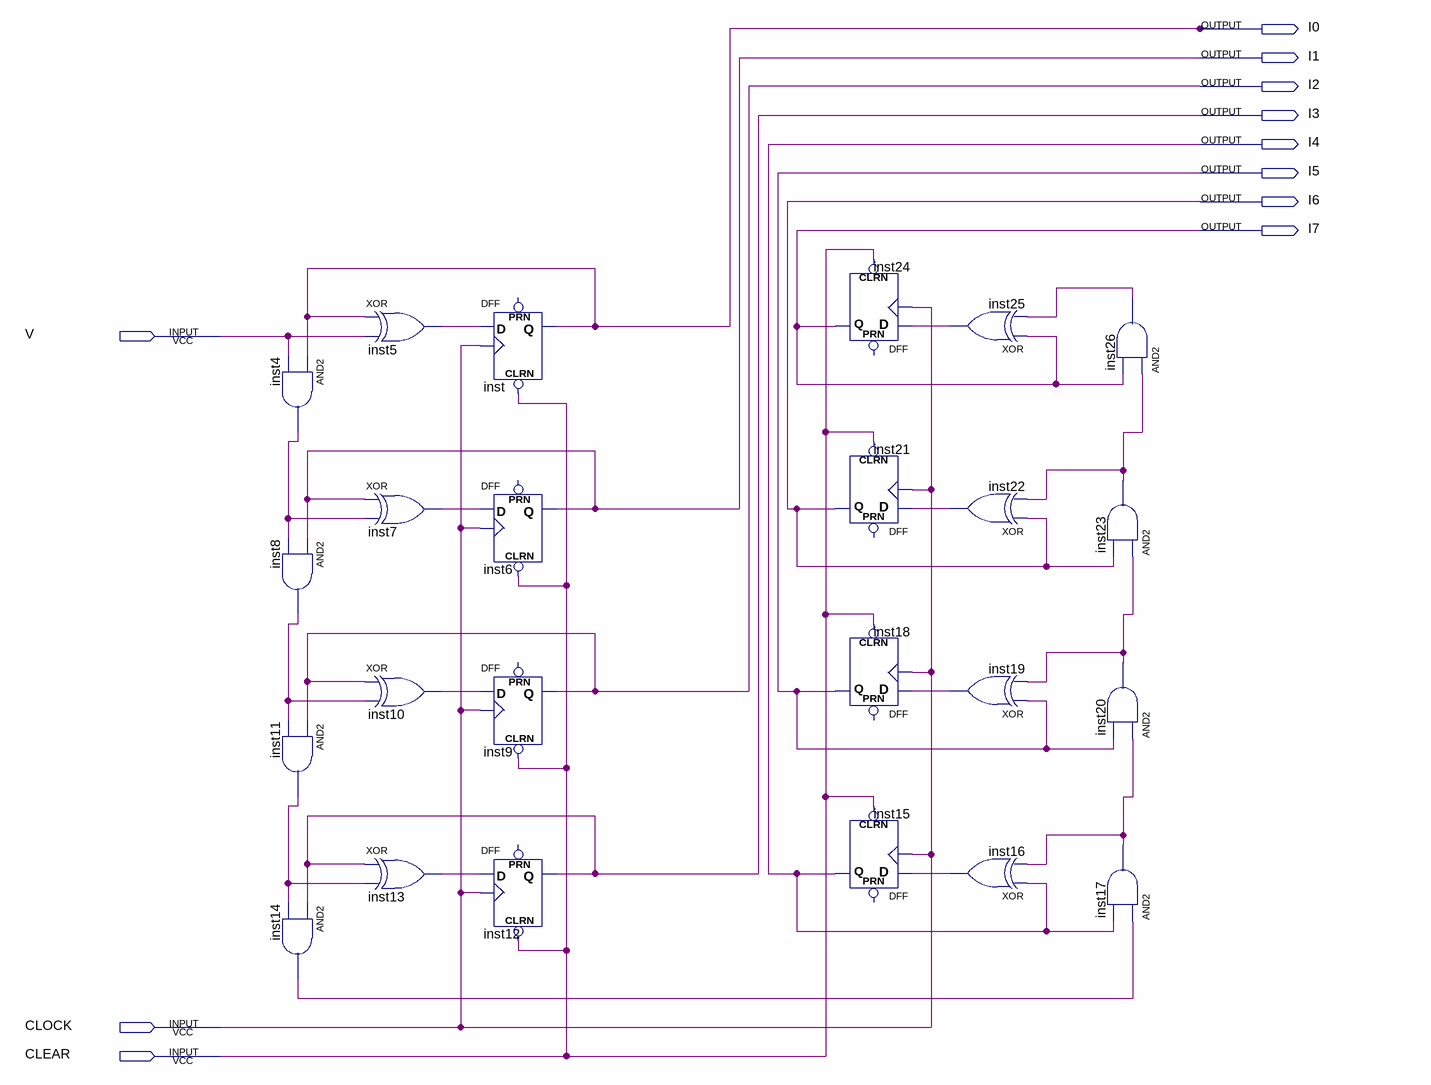
[diagram p0: schematic sheet]
// Quartus schematic 8b_syn_d_counter.bdf as structural Verilog: 24 symbols, 11 pins
module \8b_syn_d_counter  (
  input  V,
  input  CLOCK,
  input  CLEAR,
  output I0,
  output I1,
  output I2,
  output I3,
  output I4,
  output I5,
  output I6,
  output I7
);

  wire inst4_out, inst5_out, inst7_out, inst8_out, inst10_out, inst11_out, inst13_out, inst14_out,
       inst16_out, inst17_out, inst19_out, inst20_out, inst22_out, inst23_out, inst25_out, inst26_out;

  and inst4 (inst4_out, I0, V);
  and inst8 (inst8_out, I1, inst4_out);
  and inst11 (inst11_out, I2, inst8_out);
  and inst14 (inst14_out, I3, inst11_out);
  xor inst5 (inst5_out, I0, V);
  xor inst7 (inst7_out, I1, inst4_out);
  xor inst10 (inst10_out, I2, inst8_out);
  xor inst13 (inst13_out, I3, inst11_out);
  DFF inst (.CLRN(CLEAR), .CLK(CLOCK), .D(inst5_out), .Q(I0));  // open: PRN
  DFF inst6 (.CLRN(CLEAR), .CLK(CLOCK), .D(inst7_out), .Q(I1));  // open: PRN
  DFF inst9 (.CLRN(CLEAR), .CLK(CLOCK), .D(inst10_out), .Q(I2));  // open: PRN
  DFF inst12 (.CLRN(CLEAR), .CLK(CLOCK), .D(inst13_out), .Q(I3));  // open: PRN
  DFF inst24 (.CLRN(CLEAR), .CLK(CLOCK), .D(inst25_out), .Q(I7));  // open: PRN
  DFF inst21 (.CLRN(CLEAR), .CLK(CLOCK), .D(inst22_out), .Q(I6));  // open: PRN
  DFF inst18 (.CLRN(CLEAR), .CLK(CLOCK), .D(inst19_out), .Q(I5));  // open: PRN
  DFF inst15 (.CLRN(CLEAR), .CLK(CLOCK), .D(inst16_out), .Q(I4));  // open: PRN
  xor inst25 (inst25_out, I7, inst26_out);
  xor inst22 (inst22_out, I6, inst23_out);
  xor inst19 (inst19_out, I5, inst20_out);
  xor inst16 (inst16_out, I4, inst17_out);
  and inst26 (inst26_out, inst23_out, I7);
  and inst23 (inst23_out, inst20_out, I6);
  and inst20 (inst20_out, inst17_out, I5);
  and inst17 (inst17_out, inst14_out, I4);
endmodule
